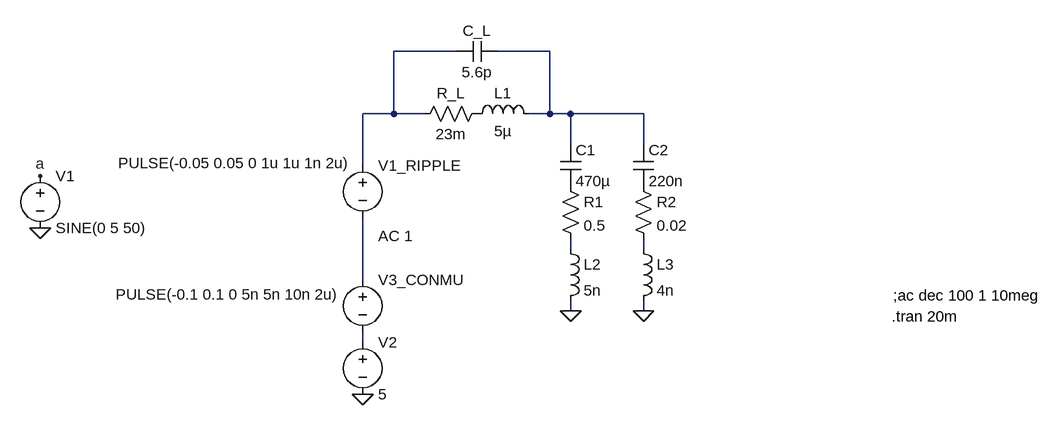
[diagram p0: schematic Draft2.asc]
Draft2.asc, the LTspice schematic file:
Version 4
SHEET 1 996 680
WIRE 80 -16 -16 -16
WIRE 224 -16 144 -16
WIRE -16 80 -16 -16
WIRE -16 80 -64 80
WIRE 32 80 -16 80
WIRE 224 80 224 -16
WIRE 224 80 192 80
WIRE 256 80 224 80
WIRE 368 80 256 80
WIRE 256 128 256 80
WIRE 368 128 368 80
WIRE -64 160 -64 80
WIRE 256 288 256 272
WIRE 368 288 368 272
WIRE -64 336 -64 240
WIRE 256 384 256 368
WIRE 368 384 368 368
WIRE -64 432 -64 416
FLAG -64 512 0
FLAG 256 384 0
FLAG -560 256 0
FLAG -560 176 a
FLAG 368 384 0
SYMBOL ind 96 96 R270
WINDOW 0 32 56 VTop 2
WINDOW 3 5 56 VBottom 2
SYMATTR InstName L1
SYMATTR Value 5µ
SYMBOL cap 240 128 R0
SYMATTR InstName C1
SYMATTR Value 470µ
SYMBOL voltage -64 144 R0
WINDOW 3 -376 12 Left 2
WINDOW 123 24 124 Left 2
WINDOW 39 0 0 Left 0
SYMATTR InstName V1_RIPPLE
SYMATTR Value PULSE(-0.05 0.05 0 1u 1u 1n 2u)
SYMATTR Value2 AC 1
SYMBOL voltage -64 416 R0
WINDOW 123 0 0 Left 0
WINDOW 39 0 0 Left 0
SYMATTR InstName V2
SYMATTR Value 5
SYMBOL res 128 64 R90
WINDOW 0 0 56 VBottom 2
WINDOW 3 32 56 VTop 2
SYMATTR InstName R_L
SYMATTR Value 23m
SYMBOL cap 144 -32 R90
WINDOW 0 0 32 VBottom 2
WINDOW 3 32 32 VTop 2
SYMATTR InstName C_L
SYMATTR Value 5.6p
SYMBOL res 240 176 R0
SYMATTR InstName R1
SYMATTR Value 0.5
SYMBOL voltage -64 320 R0
WINDOW 3 -380 38 Left 2
WINDOW 123 0 0 Left 0
WINDOW 39 0 0 Left 0
SYMATTR InstName V3_CONMU
SYMATTR Value PULSE(-0.1 0.1 0 5n 5n 10n 2u)
SYMBOL voltage -560 160 R0
WINDOW 123 0 0 Left 0
WINDOW 39 0 0 Left 0
SYMATTR InstName V1
SYMATTR Value SINE(0 5 50)
SYMBOL ind 240 272 R0
SYMATTR InstName L2
SYMATTR Value 5n
SYMBOL cap 352 128 R0
SYMATTR InstName C2
SYMATTR Value 220n
SYMBOL res 352 176 R0
SYMATTR InstName R2
SYMATTR Value 0.02
SYMBOL ind 352 272 R0
SYMATTR InstName L3
SYMATTR Value 4n
TEXT 750 392 Left 2 !.tran 20m
TEXT 752 360 Left 2 !;ac dec 100 1 10meg

The netlist it stands for:
* Draft2.asc
L1 P001 N002 5µ
C1 N002 P002 470µ
V1_RIPPLE N001 N005 PULSE(-0.05 0.05 0 1u 1u 1n 2u) AC 1
V2 N006 0 5
R_L P001 N001 23m
C_L N002 N001 5.6p
R1 P002 N003 0.5
V3_CONMU N005 N006 PULSE(-0.1 0.1 0 5n 5n 10n 2u)
V1 a 0 SINE(0 5 50)
L2 N003 0 5n
C2 N002 P003 220n
R2 P003 N004 0.02
L3 N004 0 4n
.tran 20m
;ac dec 100 1 10meg
.backanno
.end